# Altium schematic sheet ESP-WROOM32.SchDoc (part 2 of 3)
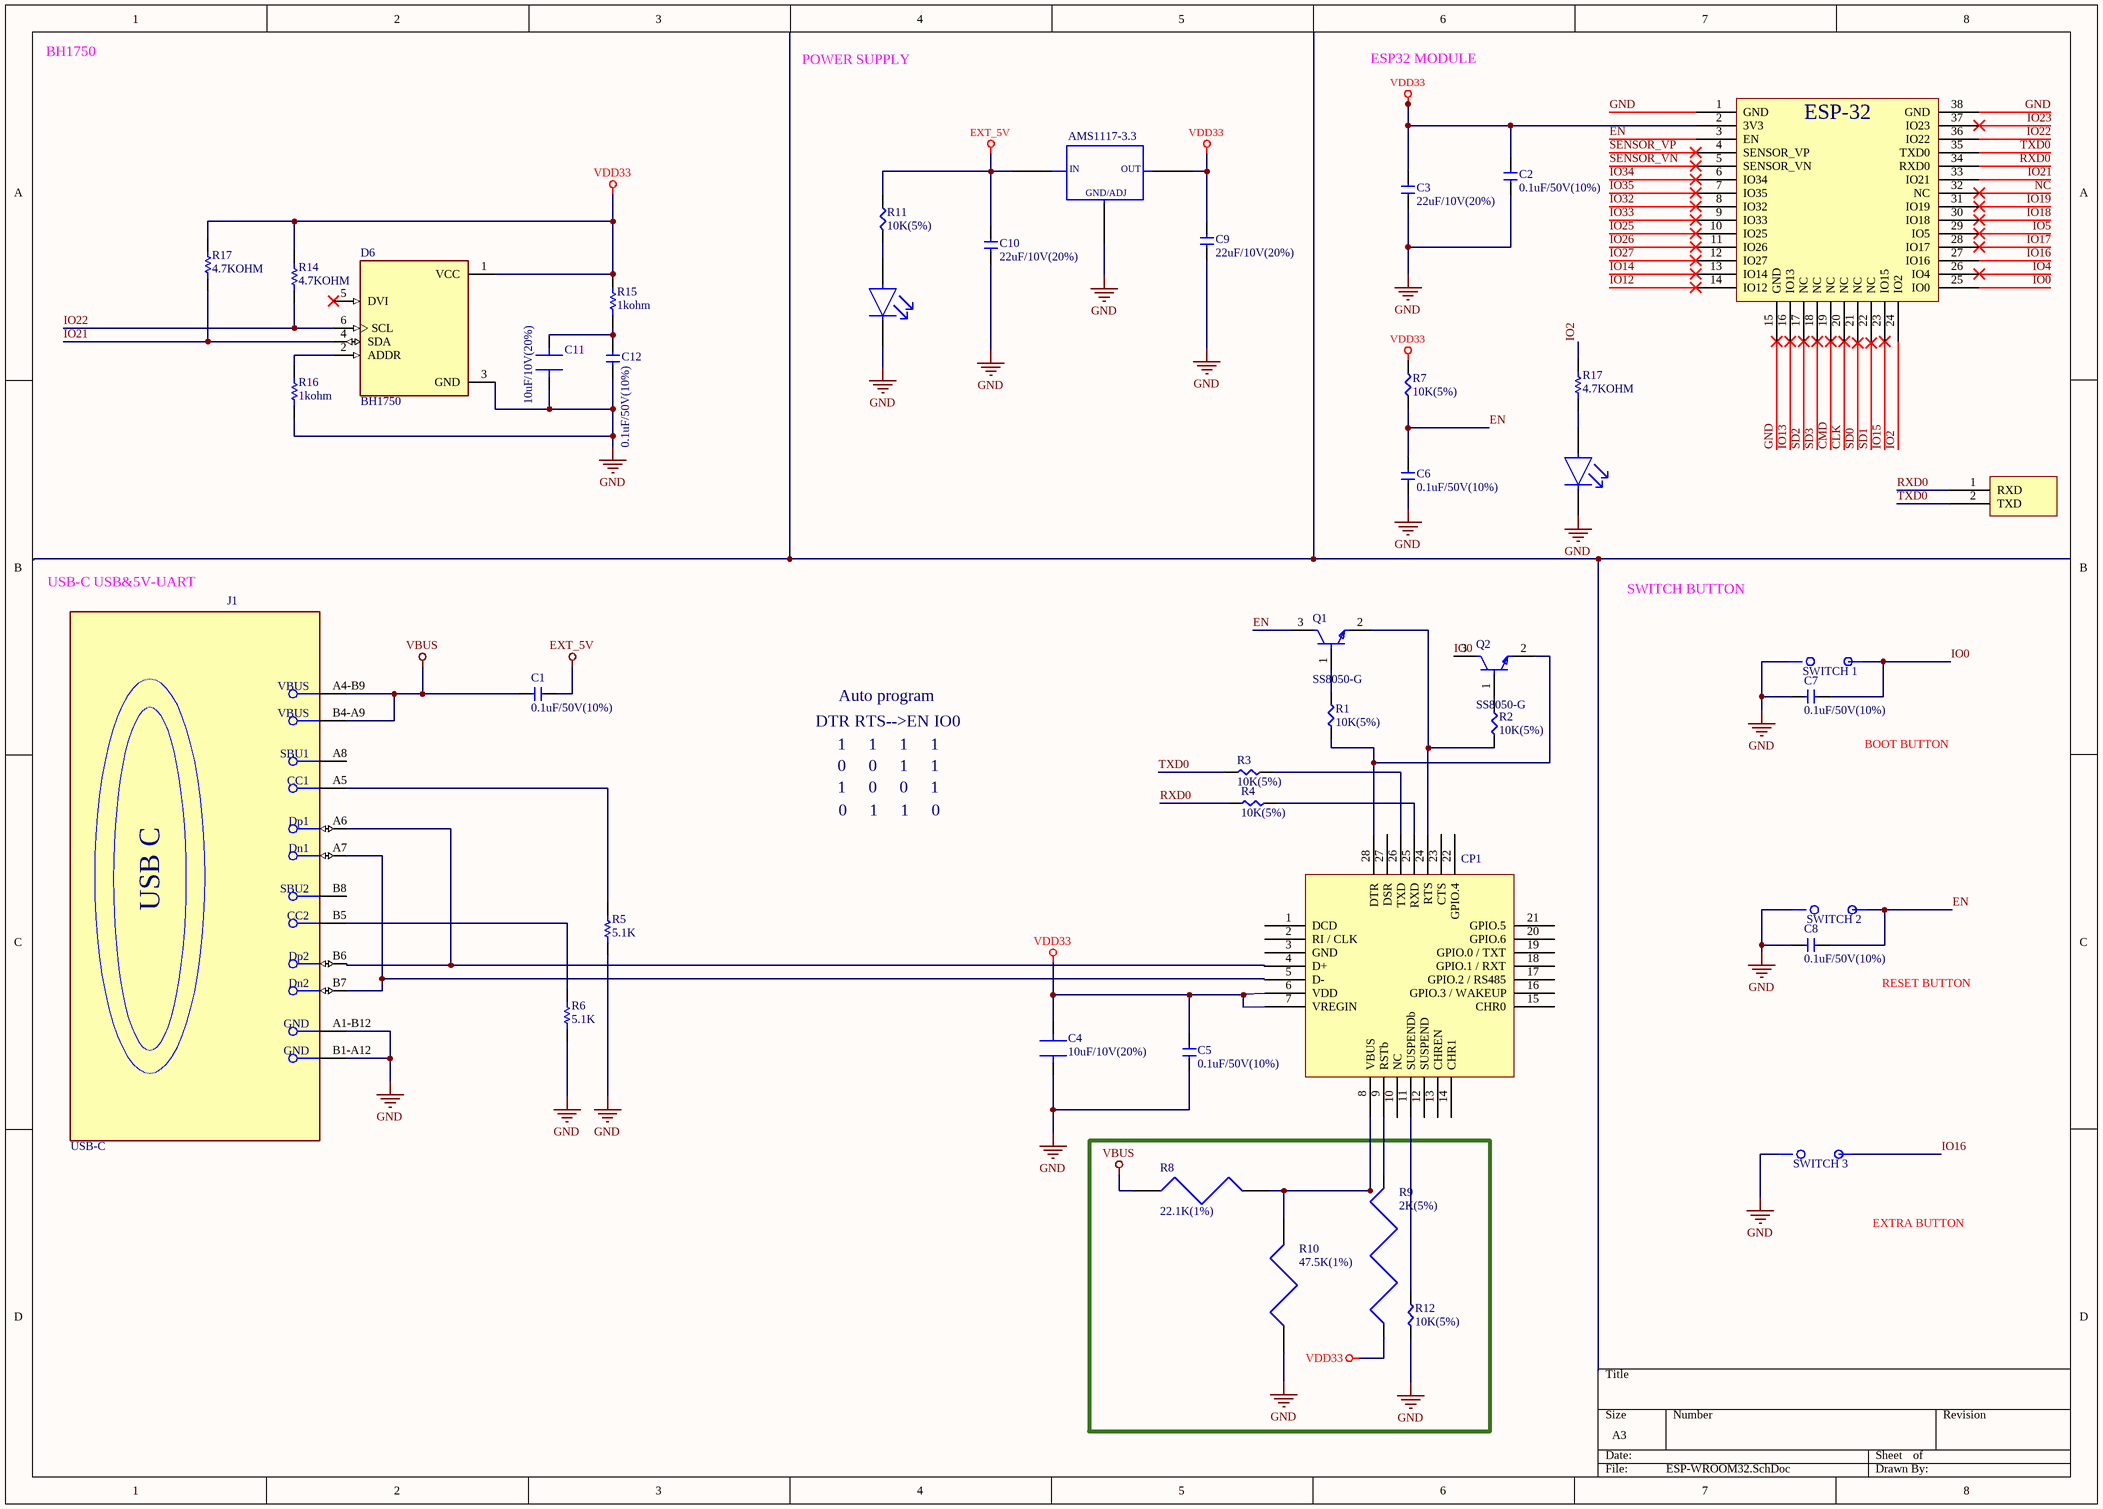
[diagram p1: ESP-WROOM32.SchDoc]
## Library data of the parts
* D4 = LTST-C170GKT: LED GREEN CLEAR SMD; Manufacturer: Lite-On; Current: 4A; Dominant Wavelength: 569nm; Forward Current: 30mA; Forward Voltage: 2.6V; Lens Color: Clear, Colorless; Luminous Intensity: 6mcd; Number of Circuits: 1; Peak Wavelength: 565nm; Power Dissipation: 100mW; Reverse Voltage: 5V; Shape: Rectangular; Test Current: 10mA; Viewing Angle: 130°; Supplier: DigiKey; Supplier Part Number: 160-1179-1-ND; Manufacturer Part Number: LTST-C170GKT; RoHS: Compliant; Category: LEDs; Stock: 1226220; Pricing: 1=0.1, 10=0.066, 100=0.0453, 500=0.03552, 1000=0.03224 (USD); Case/Package: 0805; Case Code (Imperial): 0805; Case Code (Metric): 2012; China RoHS: Compliant; Color: Green; Depth: 1.25mm; Height: 1.1mm; Illumination Color: Green; Lead Free: Lead Free; Length: 2mm; Lens Transparency: Clear; Lifecycle Status: Production; Max Operating Temperature: 85°C; Min Operating Temperature: -55°C; Mounting Technology: Surface Mount; Number of Elements: 1; Number of LEDs: 1; Pins: 2; Number of Terminals: 2; Packaging: Tape and Reel; Power Rating: 100mW; Radiation Hardening: No; REACH SVHC: Yes; Schedule B: 8541402000, 8541402000|8541402000|8541402000|8541402000|8541402000|8541402000|8541402000|8541402000|8541402000|8541402000|8541402000|8541402000|8541402000|8541402000|8541402000|8541402000|8541402000|8541402000|8541402000|8541402000|8541402000|8541402000|8541402000|85; Terminal Pitch: 2.1mm; Voltage: 5V; Wavelength: 569nm; Width: 1.25mm; ComponentLink1URL: https://datasheet.octopart.com:443/LTST-C170GKT-Lite-On-datasheet-180605137.pdf?src-supplier=IHS; ComponentLink1Description: https://datasheet.octopart.com:443/LTST-C170GKT-Lite-On-datasheet-180605137.pdf?src-supplier=IHS; ComponentLink2URL: https://datasheet.octopart.com:443/LTST-C170GKT-Lite-On-datasheet-141439001.pdf?src-supplier=Upverter; ComponentLink2Description: https://datasheet.octopart.com:443/LTST-C170GKT-Lite-On-datasheet-141439001.pdf?src-supplier=Upverter; ComponentLink3URL: https://datasheet.octopart.com:443/LTST-C170GKT-Lite-On-datasheet-159307.pdf?src-supplier=Arrow+Electronics; ComponentLink3Description: https://datasheet.octopart.com:443/LTST-C170GKT-Lite-On-datasheet-159307.pdf?src-supplier=Arrow+Electronics; ComponentLink4URL: https://datasheet.octopart.com:443/LTST-C170GKT-Lite-On-datasheet-8330158.pdf?src-supplier=TME; ComponentLink4Description: https://datasheet.octopart.com:443/LTST-C170GKT-Lite-On-datasheet-8330158.pdf?src-supplier=TME; ComponentLink5URL: https://datasheet.octopart.com:443/LTST-C170GKT-Lite-On-datasheet-26684672.pdf?src-supplier=Future+Electronics; ComponentLink5Description: https://datasheet.octopart.com:443/LTST-C170GKT-Lite-On-datasheet-26684672.pdf?src-supplier=Future+Electronics; ComponentLink6URL: https://datasheet.octopart.com:443/LTST-C170GKT-Lite-On-datasheet-59241.pdf?src-supplier=DigiKey; ComponentLink6Description: https://datasheet.octopart.com:443/LTST-C170GKT-Lite-On-datasheet-59241.pdf?src-supplier=DigiKey; ComponentLink7URL: https://datasheet.octopart.com:443/LTST-C170GKT-Lite-On-datasheet-14174986.pdf?src-supplier=iiiC; ComponentLink7Description: https://datasheet.octopart.com:443/LTST-C170GKT-Lite-On-datasheet-14174986.pdf?src-supplier=iiiC; LCSC PART NUMBER: C125090
*1 = ESP32-WROOM-32E-N4: RF TXRX MOD BT WIFI TH SMD; Manufacturer: Espressif Systems; Max Supply Voltage: 3.6V; Min Supply Voltage: 3V; Operating Supply Voltage: 3.3V; Supplier: DigiKey; Supplier Part Number: 1965-ESP32-WROOM-32E-N4CT-ND; Manufacturer Part Number: ESP32-WROOM-32E-N4; RoHS: Compliant; Category: System on Chip (SoC); Stock: 16186; Pricing: 1=4.84, 10=4.189, 25=3.9612, 100=3.649, 250=3.46184 (USD); Height - Seated (Max): 3.25mm; Length: 25.5mm; Max Operating Temperature: 85°C; Min Operating Temperature: -40°C; Number of Terminals: 38; Terminal Pitch: 1.27mm; Width: 18mm; ComponentLink1URL: https://datasheet.octopart.com:443/ESP32-WROOM-32E-N4-Espressif-Systems-datasheet-182247776.pdf?src-supplier=IHS; ComponentLink1Description: https://datasheet.octopart.com:443/ESP32-WROOM-32E-N4-Espressif-Systems-datasheet-182247776.pdf?src-supplier=IHS; ComponentLink2URL: https://datasheet.octopart.com:443/ESP32-WROOM-32E-N4-Espressif-Systems-datasheet-188867343.pdf?src-supplier=TME; ComponentLink2Description: https://datasheet.octopart.com:443/ESP32-WROOM-32E-N4-Espressif-Systems-datasheet-188867343.pdf?src-supplier=TME; ComponentLink3URL: https://datasheet.octopart.com:443/ESP32-WROOM-32E-N4-Espressif-Systems-datasheet-165560559.pdf?src-supplier=TME; ComponentLink3Description: https://datasheet.octopart.com:443/ESP32-WROOM-32E-N4-Espressif-Systems-datasheet-165560559.pdf?src-supplier=TME; ComponentLink4URL: https://datasheet.octopart.com:443/ESP32-WROOM-32E-N4-Espressif-Systems-datasheet-151884363.pdf?src-supplier=Future+Electronics; ComponentLink4Description: https://datasheet.octopart.com:443/ESP32-WROOM-32E-N4-Espressif-Systems-datasheet-151884363.pdf?src-supplier=Future+Electronics; LCSC part number: C701341
C1 C2 C5-C8 C12 = C1206C104K5JACAUTO: CAP CER 0.1UF 50V U2J 1206; Manufacturer: Samsung Electro-Mechanics; Manufacturer Part Number: CL05B104KB5NNWC; LSCS PART NUMBER: C2264143; Value: 100nF; Dielectric Material: Ceramic; Supplier: DigiKey; Supplier Part Number: 1276-CL05B104KB5NNWCCT-ND; RoHS: Compliant; Category: Ceramic Capacitors; Stock: 89724; Pricing: 1=0.1, 10=0.054, 50=0.037, 100=0.0319, 500=0.02338, 1000=0.02075, 2500=0.018, 5000=0.01634 (USD); China RoHS: Compliant; Lifecycle Status: Production; Max Operating Temperature: 125°C; Min Operating Temperature: -55°C; Mounting Technology: Surface Mount; Number of Terminals: 2; REACH SVHC: Yes; Schedule B: 8532240020, 8532240020|8532240020|8532240020|8532240020|8532240020; Voltage Rating (DC): 50V; ComponentLink1URL: https://datasheet.octopart.com:443/CL05B104KB5NNWC-Samsung-Electro-Mechanics-datasheet-182018729.pdf?src-supplier=IHS; ComponentLink1Description: https://datasheet.octopart.com:443/CL05B104KB5NNWC-Samsung-Electro-Mechanics-datasheet-182018729.pdf?src-supplier=IHS; LCSC part number: C7229230; Case/Package: 1206; Dielectric: U2J; Height: 1.2mm; Length: 3.2mm; Material: Ceramic; Voltage Rating: 50V; Width: 1.6mm; ComponentLink2URL: https://datasheet.octopart.com:443/C1206C104K5JACAUTO-KEMET-datasheet-175574894.pdf?src-supplier=IHS; ComponentLink2Description: https://datasheet.octopart.com:443/C1206C104K5JACAUTO-KEMET-datasheet-175574894.pdf?src-supplier=IHS; ComponentLink3URL: https://datasheet.octopart.com:443/C1206C104K5JACAUTO-KEMET-datasheet-138896532.pdf?src-supplier=Upverter; ComponentLink3Description: https://datasheet.octopart.com:443/C1206C104K5JACAUTO-KEMET-datasheet-138896532.pdf?src-supplier=Upverter; ComponentLink4URL: https://datasheet.octopart.com:443/C1206C104K5JACAUTO-KEMET-datasheet-141421995.pdf?src-supplier=Farnell; ComponentLink4Description: https://datasheet.octopart.com:443/C1206C104K5JACAUTO-KEMET-datasheet-141421995.pdf?src-supplier=Farnell; ComponentLink5URL: https://datasheet.octopart.com:443/C1206C104K5JACAUTO-KEMET-datasheet-110724407.pdf?src-supplier=RS+(Formerly+Allied+Electronics); ComponentLink5Description: https://datasheet.octopart.com:443/C1206C104K5JACAUTO-KEMET-datasheet-110724407.pdf?src-supplier=RS+(Formerly+Allied+Electronics)
C3 C9 C10 = CC1206MKX5R6BB226: CAP CER 22UF 10V X5R 1206; Manufacturer: Murata; Manufacturer Part Number: GRM158R61A226ME15D; Manufacturer Lifecycle Status: IN PRODUCTION; LSCS PART NUMBER: C723738; Value: 22µF; Dielectric Material: Ceramic; Supplier: DigiKey; Supplier Part Number: 490-GRM158R61A226ME15DCT-ND; RoHS: Compliant; Category: Ceramic Capacitors; Stock: 340623; Pricing: 1=0.41, 10=0.247, 50=0.1828, 100=0.1632, 500=0.1301, 1000=0.1199, 2500=0.10912 (USD); Case/Package: 0402; Dielectric: X5R; Height: 800µm; Length: 1mm; Lifecycle Status: Production; Material: Ceramic; Max Operating Temperature: 85°C; Min Operating Temperature: -55°C; Mounting Technology: Surface Mount; Number of Terminals: 2; REACH SVHC: Yes; Thickness: 800µm; Tolerance: 20%; Voltage Rating: 10V; Voltage Rating (DC): 10V; Width: 500µm; ComponentLink1URL: https://datasheet.octopart.com:443/GRM158R61A226ME15D-Murata-datasheet-165579666.pdf?src-supplier=TME; ComponentLink1Description: https://datasheet.octopart.com:443/GRM158R61A226ME15D-Murata-datasheet-165579666.pdf?src-supplier=TME; ComponentLink2URL: https://datasheet.octopart.com/GRM158R61A226ME15D-Murata-datasheet-12515295.pdf; ComponentLink2Description: https://datasheet.octopart.com/GRM158R61A226ME15D-Murata-datasheet-12515295.pdf; ComponentLink3URL: https://datasheet.octopart.com/GRM158R61A226ME15D-Murata-datasheet-12510076.pdf; ComponentLink3Description: https://datasheet.octopart.com/GRM158R61A226ME15D-Murata-datasheet-12510076.pdf; ComponentLink4URL: https://datasheet.octopart.com/GRM158R61A226ME15D-Murata-datasheet-11978611.pdf; ComponentLink4Description: https://datasheet.octopart.com/GRM158R61A226ME15D-Murata-datasheet-11978611.pdf; ComponentLink5URL: https://datasheet.octopart.com/GRM158R61A226ME15D-Murata-datasheet-10025737.pdf; ComponentLink5Description: https://datasheet.octopart.com/GRM158R61A226ME15D-Murata-datasheet-10025737.pdf; ComponentLink6URL: https://datasheet.octopart.com/GRM158R61A226ME15D-Murata-datasheet-8819587.pdf; ComponentLink6Description: https://datasheet.octopart.com/GRM158R61A226ME15D-Murata-datasheet-8819587.pdf; ComponentLink7URL: http://sigma.octopart.com:80/reach_statement/Murata-company-16.pdf?src-supplier=Compliance+Statements; ComponentLink7Description: http://sigma.octopart.com:80/reach_statement/Murata-company-16.pdf?src-supplier=Compliance+Statements; LCSC part number: C3845593; Case Code (Imperial): 1206; Case Code (Metric): 3216; China RoHS: Compliant; Halogen Free: Halogen Free; Lead Free: Lead Free; Schedule B: 8532240020, 8532240020|8532240020|8532240020|8532240020|8532240020; ComponentLink8URL: https://datasheet.octopart.com:443/CC1206MKX5R6BB226-Yageo-datasheet-170350636.pdf?src-supplier=IHS; ComponentLink8Description: https://datasheet.octopart.com:443/CC1206MKX5R6BB226-Yageo-datasheet-170350636.pdf?src-supplier=IHS; ComponentLink9URL: https://datasheet.octopart.com:443/CC1206MKX5R6BB226-Yageo-datasheet-182965674.pdf?src-supplier=Farnell; ComponentLink9Description: https://datasheet.octopart.com:443/CC1206MKX5R6BB226-Yageo-datasheet-182965674.pdf?src-supplier=Farnell; ComponentLink10URL: https://datasheet.octopart.com:443/CC1206MKX5R6BB226-Yageo-Group-datasheet-145016144.pdf?src-supplier=ODG+(Origin+Data+Global); ComponentLink10Description: https://datasheet.octopart.com:443/CC1206MKX5R6BB226-Yageo-Group-datasheet-145016144.pdf?src-supplier=ODG+(Origin+Data+Global); ComponentLink11URL: https://datasheet.octopart.com:443/CC1206MKX5R6BB226-Yageo-datasheet-137700085.pdf?src-supplier=Future+Electronics; ComponentLink11Description: https://datasheet.octopart.com:443/CC1206MKX5R6BB226-Yageo-datasheet-137700085.pdf?src-supplier=Future+Electronics; ComponentLink12URL: https://datasheet.octopart.com:443/CC1206MKX5R6BB226-Yageo-datasheet-82288757.pdf?src-supplier=Future+Electronics; ComponentLink12Description: https://datasheet.octopart.com:443/CC1206MKX5R6BB226-Yageo-datasheet-82288757.pdf?src-supplier=Future+Electronics; ComponentLink13URL: https://datasheet.octopart.com:443/CC1206MKX5R6BB226-Yageo-datasheet-78855685.pdf?src-supplier=Future+Electronics; ComponentLink13Description: https://datasheet.octopart.com:443/CC1206MKX5R6BB226-Yageo-datasheet-78855685.pdf?src-supplier=Future+Electronics; ComponentLink14URL: https://datasheet.octopart.com:443/CC1206MKX5R6BB226-Yageo-datasheet-62336348.pdf?src-supplier=Future+Electronics; ComponentLink14Description: https://datasheet.octopart.com:443/CC1206MKX5R6BB226-Yageo-datasheet-62336348.pdf?src-supplier=Future+Electronics; ComponentLink15URL: https://datasheet.octopart.com:443/CC1206MKX5R6BB226-Yageo-datasheet-68298032.pdf?src-supplier=Future+Electronics; ComponentLink15Description: https://datasheet.octopart.com:443/CC1206MKX5R6BB226-Yageo-datasheet-68298032.pdf?src-supplier=Future+Electronics; ComponentLink16URL: https://datasheet.octopart.com/CC1206MKX5R6BB226-Yageo-datasheet-86397281.pdf; ComponentLink16Description: https://datasheet.octopart.com/CC1206MKX5R6BB226-Yageo-datasheet-86397281.pdf; ComponentLink17URL: http://sigma.octopart.com:80/rohs_statement/Yageo-company-2.pdf?src-supplier=Compliance+Statements; ComponentLink17Description: http://sigma.octopart.com:80/rohs_statement/Yageo-company-2.pdf?src-supplier=Compliance+Statements; ComponentLink18URL: http://sigma.octopart.com:80/conflict_mineral_statement/Yageo-company-3.pdf?src-supplier=Compliance+Statements; ComponentLink18Description: http://sigma.octopart.com:80/conflict_mineral_statement/Yageo-company-3.pdf?src-supplier=Compliance+Statements
C4 C11 = CC1206KKX5R6BB106: CAP CER 10UF 10V X5R 1206; Manufacturer: Yageo Group; Manufacturer Part Number: CC0402MRX5R6BB106; LSCS PART NUMBER: C527332; Value: 10µF; Dielectric Material: Ceramic; Tolerance: 10%; Supplier: DigiKey; Supplier Part Number: 13-CC0402MRX5R6BB106CT-ND; RoHS: Compliant; Category: Ceramic Capacitors; Stock: 59624; Pricing: 1=0.21, 10=0.121, 50=0.0866, 100=0.076, 500=0.05824, 1000=0.05277, 2500=0.04701, 5000=0.04354 (USD); Case/Package: 0402; China RoHS: Compliant; Dielectric: X5R; Halogen Free: Halogen Free; Height: 500µm; Lead Free: Lead Free; Length: 1mm; Lifecycle Status: Production; Max Operating Temperature: 85°C; Min Operating Temperature: -55°C; Mounting Technology: Surface Mount; Number of Terminals: 2; REACH SVHC: Yes; Voltage Rating (DC): 10V; Width: 500µm; ComponentLink1URL: https://datasheet.octopart.com:443/CC0402MRX5R6BB106-Yageo-datasheet-170350636.pdf?src-supplier=IHS; ComponentLink1Description: https://datasheet.octopart.com:443/CC0402MRX5R6BB106-Yageo-datasheet-170350636.pdf?src-supplier=IHS; ComponentLink2URL: https://datasheet.octopart.com:443/CC0402MRX5R6BB106-Yageo-Group-datasheet-189192896.pdf?src-supplier=TME; ComponentLink2Description: https://datasheet.octopart.com:443/CC0402MRX5R6BB106-Yageo-Group-datasheet-189192896.pdf?src-supplier=TME; ComponentLink3URL: https://datasheet.octopart.com:443/CC0402MRX5R6BB106-Yageo-datasheet-182029486.pdf?src-supplier=Newark; ComponentLink3Description: https://datasheet.octopart.com:443/CC0402MRX5R6BB106-Yageo-datasheet-182029486.pdf?src-supplier=Newark; ComponentLink4URL: https://datasheet.octopart.com:443/CC0402MRX5R6BB106-Yageo-datasheet-158238148.pdf?src-supplier=Newark; ComponentLink4Description: https://datasheet.octopart.com:443/CC0402MRX5R6BB106-Yageo-datasheet-158238148.pdf?src-supplier=Newark; ComponentLink5URL: https://datasheet.octopart.com/CC0402MRX5R6BB106-Yageo-datasheet-86397281.pdf; ComponentLink5Description: https://datasheet.octopart.com/CC0402MRX5R6BB106-Yageo-datasheet-86397281.pdf; ComponentLink6URL: https://datasheet.octopart.com:443/CC0402MRX5R6BB106-Yageo-datasheet-175963154.pdf?src-supplier=element14+APAC; ComponentLink6Description: https://datasheet.octopart.com:443/CC0402MRX5R6BB106-Yageo-datasheet-175963154.pdf?src-supplier=element14+APAC; ComponentLink7URL: https://datasheet.octopart.com:443/CC0402MRX5R6BB106-Yageo-Group-datasheet-145016144.pdf?src-supplier=ODG+(Origin+Data+Global); ComponentLink7Description: https://datasheet.octopart.com:443/CC0402MRX5R6BB106-Yageo-Group-datasheet-145016144.pdf?src-supplier=ODG+(Origin+Data+Global); ComponentLink8URL: https://datasheet.octopart.com:443/CC0402MRX5R6BB106-Yageo-datasheet-62067349.pdf?src-supplier=Future+Electronics; ComponentLink8Description: https://datasheet.octopart.com:443/CC0402MRX5R6BB106-Yageo-datasheet-62067349.pdf?src-supplier=Future+Electronics; ComponentLink9URL: http://sigma.octopart.com:80/conflict_mineral_statement/Yageo-company-3.pdf?src-supplier=Compliance+Statements; ComponentLink9Description: http://sigma.octopart.com:80/conflict_mineral_statement/Yageo-company-3.pdf?src-supplier=Compliance+Statements; ComponentLink10URL: http://sigma.octopart.com:80/rohs_statement/Yageo-company-2.pdf?src-supplier=Compliance+Statements; ComponentLink10Description: http://sigma.octopart.com:80/rohs_statement/Yageo-company-2.pdf?src-supplier=Compliance+Statements; LCSC PART NUMBER: C962143; Case Code (Imperial): 1206; Case Code (Metric): 3216; Composition: Ceramic; Depth: 1.6mm; Pins: 2; Radiation Hardening: No; Termination: SMD/SMT; Thickness: 1.8034mm; Voltage Rating: 10V; Voltage Rating (AC): 10V; Weight: 16.187578mg; ComponentLink11URL: https://datasheet.octopart.com:443/CC1206KKX5R6BB106-Yageo-datasheet-170350636.pdf?src-supplier=IHS; ComponentLink11Description: https://datasheet.octopart.com:443/CC1206KKX5R6BB106-Yageo-datasheet-170350636.pdf?src-supplier=IHS; ComponentLink12URL: https://datasheet.octopart.com:443/CC1206KKX5R6BB106-Yageo-datasheet-10911834.pdf?src-supplier=element14+APAC; ComponentLink12Description: https://datasheet.octopart.com:443/CC1206KKX5R6BB106-Yageo-datasheet-10911834.pdf?src-supplier=element14+APAC; ComponentLink13URL: https://datasheet.octopart.com:443/CC1206KKX5R6BB106-Yageo-datasheet-62067349.pdf?src-supplier=element14+APAC; ComponentLink13Description: https://datasheet.octopart.com:443/CC1206KKX5R6BB106-Yageo-datasheet-62067349.pdf?src-supplier=element14+APAC; ComponentLink14URL: https://datasheet.octopart.com:443/CC1206KKX5R6BB106-Yageo-datasheet-181970622.pdf?src-supplier=Farnell; ComponentLink14Description: https://datasheet.octopart.com:443/CC1206KKX5R6BB106-Yageo-datasheet-181970622.pdf?src-supplier=Farnell; ComponentLink15URL: https://datasheet.octopart.com:443/CC1206KKX5R6BB106-Yageo-datasheet-181970623.pdf?src-supplier=Farnell; ComponentLink15Description: https://datasheet.octopart.com:443/CC1206KKX5R6BB106-Yageo-datasheet-181970623.pdf?src-supplier=Farnell; ComponentLink16URL: https://datasheet.octopart.com:443/CC1206KKX5R6BB106-Yageo-datasheet-175963154.pdf?src-supplier=JRH+Electronics; ComponentLink16Description: https://datasheet.octopart.com:443/CC1206KKX5R6BB106-Yageo-datasheet-175963154.pdf?src-supplier=JRH+Electronics; ComponentLink17URL: https://datasheet.octopart.com:443/CC1206KKX5R6BB106-Yageo-datasheet-158238148.pdf?src-supplier=Newark; ComponentLink17Description: https://datasheet.octopart.com:443/CC1206KKX5R6BB106-Yageo-datasheet-158238148.pdf?src-supplier=Newark; ComponentLink18URL: https://datasheet.octopart.com:443/CC1206KKX5R6BB106-Yageo-datasheet-8359971.pdf?src-supplier=Newark; ComponentLink18Description: https://datasheet.octopart.com:443/CC1206KKX5R6BB106-Yageo-datasheet-8359971.pdf?src-supplier=Newark; ComponentLink19URL: https://datasheet.octopart.com/CC1206KKX5R6BB106-Yageo-datasheet-86397281.pdf; ComponentLink19Description: https://datasheet.octopart.com/CC1206KKX5R6BB106-Yageo-datasheet-86397281.pdf; ComponentLink20URL: https://datasheet.octopart.com:443/CC1206KKX5R6BB106-Yageo-datasheet-8324442.pdf?src-supplier=Future+Electronics; ComponentLink20Description: https://datasheet.octopart.com:443/CC1206KKX5R6BB106-Yageo-datasheet-8324442.pdf?src-supplier=Future+Electronics; ComponentLink21URL: https://datasheet.octopart.com:443/CC1206KKX5R6BB106-Yageo-datasheet-137875056.pdf?src-supplier=Future+Electronics; ComponentLink21Description: https://datasheet.octopart.com:443/CC1206KKX5R6BB106-Yageo-datasheet-137875056.pdf?src-supplier=Future+Electronics; ComponentLink22URL: https://datasheet.octopart.com:443/CC1206KKX5R6BB106-Yageo-datasheet-59875459.pdf?src-supplier=Future+Electronics; ComponentLink22Description: https://datasheet.octopart.com:443/CC1206KKX5R6BB106-Yageo-datasheet-59875459.pdf?src-supplier=Future+Electronics; ComponentLink23URL: https://datasheet.octopart.com:443/CC1206KKX5R6BB106-Yageo-datasheet-27626583.pdf?src-supplier=Future+Electronics; ComponentLink23Description: https://datasheet.octopart.com:443/CC1206KKX5R6BB106-Yageo-datasheet-27626583.pdf?src-supplier=Future+Electronics; ComponentLink24URL: https://datasheet.octopart.com:443/CC1206KKX5R6BB106-Yageo-datasheet-24580494.pdf?src-supplier=Future+Electronics; ComponentLink24Description: https://datasheet.octopart.com:443/CC1206KKX5R6BB106-Yageo-datasheet-24580494.pdf?src-supplier=Future+Electronics; ComponentLink25URL: https://datasheet.octopart.com:443/CC1206KKX5R6BB106-Yageo-datasheet-14389981.pdf?src-supplier=Future+Electronics; ComponentLink25Description: https://datasheet.octopart.com:443/CC1206KKX5R6BB106-Yageo-datasheet-14389981.pdf?src-supplier=Future+Electronics; ComponentLink26URL: https://datasheet.octopart.com:443/CC1206KKX5R6BB106-Yageo-datasheet-149070021.pdf?src-supplier=TME; ComponentLink26Description: https://datasheet.octopart.com:443/CC1206KKX5R6BB106-Yageo-datasheet-149070021.pdf?src-supplier=TME; ComponentLink27URL: https://datasheet.octopart.com:443/CC1206KKX5R6BB106-Yageo-Group-datasheet-145016144.pdf?src-supplier=ODG+(Origin+Data+Global); ComponentLink27Description: https://datasheet.octopart.com:443/CC1206KKX5R6BB106-Yageo-Group-datasheet-145016144.pdf?src-supplier=ODG+(Origin+Data+Global)
CP1 = CP2102N-A02-GQFN28: USB Bridge, USB to UART USB 2.0 UART Interface 28-QFN (5x5); Manufacturer: Silicon Labs; Manufacturer Lifecycle Status: FULL PRODUCTION; Data Rate: 1.5Mbps; Max Junction Temperature (Tj): 105°C; Max Supply Voltage: 3.6V; Min Supply Voltage: 3V; Number of Digital IO: 7; Number of Ports: 1; Operating Supply Voltage: 3.3V; USB Standard: USB 2.0; Supplier: DigiKey; Supplier Part Number: 336-5889-ND; Manufacturer Part Number: CP2102N-A02-GQFN28; RoHS: Compliant; Category: USB Interface ICs; Stock: 1307; Pricing: 1=4.32, 10=3.275, 73=2.78205, 146=2.66534, 292=2.56928, 511=2.50429, 1022=2.43673, 2555=2.36542 (USD); Ambient Temperature Range High: 85°C; China RoHS: Compliant; Height: 800µm; Height - Seated (Max): 800µm; Interface: UART; Length: 5mm; Lifecycle Status: Production; Max Operating Temperature: 85°C; Min Operating Temperature: -40°C; Number of Terminals: 28; REACH SVHC: Yes; Terminal Pitch: 500µm; Width: 5mm; ComponentLink1URL: https://datasheet.octopart.com:443/CP2102N-A02-GQFN28-Silicon-Labs-datasheet-138898368.pdf?src-supplier=Augswan; ComponentLink1Description: https://datasheet.octopart.com:443/CP2102N-A02-GQFN28-Silicon-Labs-datasheet-138898368.pdf?src-supplier=Augswan; ComponentLink2URL: https://datasheet.octopart.com:443/CP2102N-A02-GQFN28-Silicon-Labs-datasheet-166051788.pdf?src-supplier=IHS; ComponentLink2Description: https://datasheet.octopart.com:443/CP2102N-A02-GQFN28-Silicon-Labs-datasheet-166051788.pdf?src-supplier=IHS; LCSC PART NUMBER: C964632
D6 = BH1750FVI-TR: SENSOR OPT 560NM AMBIENT 6WSOF; Manufacturer: ROHM; Interface: I2C, Serial; Clock Frequency: 400kHz; Max Power Dissipation: 260mW; Max Supply Voltage: 3.6V; Min Supply Voltage: 2.4V; Number of Circuits: 1; Operating Supply Current: 120µA; Operating Supply Voltage: 3V; Output Type: Digital, I2C; Sensing Method: Optical; Type: Integrated Circuit (IC); Supplier: DigiKey; Supplier Part Number: BH1750FVICT-ND; Manufacturer Part Number: BH1750FVI-TR; RoHS: Compliant; Category: Optical Sensors; Stock: 3509; Pricing: 1=3.29, 5=2.934, 10=2.804, 25=2.648, 50=2.542, 100=2.4447, 500=2.24896, 1000=2.18484 (USD); Case/Package: SMD/SMT; Contact Plating: Copper, Tin; Height: 750µm; Height - Seated (Max): 750µm; Lead Free: Lead Free; Length: 2.6mm; Lifecycle Status: Obsolete; Max Operating Temperature: 85°C; Min Operating Temperature: -40°C; Mounting Technology: Surface Mount; Pins: 6; Number of Terminals: 6; Radiation Hardening: No; REACH SVHC: Yes; Schedule B: 8541409500; Terminal Pitch: 500µm; Wavelength: 560nm; Width: 1.6mm; ComponentLink1URL: https://sigma.octopart.com:443/169791153/technical_drawing/ROHM-BH1750FVI-TR.pdf?src-supplier=Upverter; ComponentLink1Description: https://sigma.octopart.com:443/169791153/technical_drawing/ROHM-BH1750FVI-TR.pdf?src-supplier=Upverter; ComponentLink2URL: https://datasheet.octopart.com:443/BH1750FVI-TR-Rohm-datasheet-141422541.pdf?src-supplier=Upverter; ComponentLink2Description: https://datasheet.octopart.com:443/BH1750FVI-TR-Rohm-datasheet-141422541.pdf?src-supplier=Upverter; ComponentLink3URL: https://datasheet.octopart.com:443/BH1750FVI-TR-ROHM-datasheet-169791149.pdf?src-supplier=Upverter; ComponentLink3Description: https://datasheet.octopart.com:443/BH1750FVI-TR-ROHM-datasheet-169791149.pdf?src-supplier=Upverter; ComponentLink4URL: https://datasheet.octopart.com:443/BH1750FVI-TR-Rohm-datasheet-25365051.pdf?src-supplier=Newark; ComponentLink4Description: https://datasheet.octopart.com:443/BH1750FVI-TR-Rohm-datasheet-25365051.pdf?src-supplier=Newark; ComponentLink5URL: https://datasheet.octopart.com:443/BH1750FVI-TR-Rohm-datasheet-8331172.pdf?src-supplier=_legacy+Avnet; ComponentLink5Description: https://datasheet.octopart.com:443/BH1750FVI-TR-Rohm-datasheet-8331172.pdf?src-supplier=_legacy+Avnet; ComponentLink6URL: https://datasheet.octopart.com:443/BH1750FVI-TR-Rohm-datasheet-145014626.pdf?src-supplier=Future+Electronics; ComponentLink6Description: https://datasheet.octopart.com:443/BH1750FVI-TR-Rohm-datasheet-145014626.pdf?src-supplier=Future+Electronics; ComponentLink7URL: https://datasheet.octopart.com:443/BH1750FVI-TR-Rohm-datasheet-14434783.pdf?src-supplier=Factory+Futures; ComponentLink7Description: https://datasheet.octopart.com:443/BH1750FVI-TR-Rohm-datasheet-14434783.pdf?src-supplier=Factory+Futures; LCSC PART NUMBER: C78960
J1 = 2171790001: CONN RCP USB2.0 TYP C 24P SMD RA; Manufacturer: Molex; Manufacturer Part Number: 217179-0001; Contact Resistance: 50mΩ; Current Rating: 1.25A; Dielectric Material: Polyamide; Gender: Receptacle; Insulation Resistance: 100MΩ; Number of Contacts: 16; Number of Ports: 1; Voltage Rating: 30V; Supplier: DigiKey; Supplier Part Number: 900-2171790001CT-ND; RoHS: Compliant; Category: USB Connectors; Stock: 5295; Pricing: 1=0.83, 10=0.704, 25=0.6596, 50=0.628, 100=0.598, 250=0.56052, 500=0.53374 (USD); Contact Gender: Female; Contact Material: Gold, Nickel; Height: 3.36mm; Lifecycle Status: Production; Max Operating Temperature: 85°C; Min Operating Temperature: -40°C; Pins: 16; Number of Rows: 1; REACH SVHC: Yes; Shell Finish: Nickel; Shell Material: Stainless Steel; Terminal Pitch: 500µm; USB Standard: USB 2.0; ComponentLink1URL: https://datasheet.octopart.com:443/217179-0001-Molex-datasheet-158871109.pdf?src-supplier=ODG+(Origin+Data+Global); ComponentLink1Description: https://datasheet.octopart.com:443/217179-0001-Molex-datasheet-158871109.pdf?src-supplier=ODG+(Origin+Data+Global); ComponentLink2URL: https://sigma.octopart.com:443/158871110/technical_drawing/Molex-217179-0001.pdf?src-supplier=Upverter; ComponentLink2Description: https://sigma.octopart.com:443/158871110/technical_drawing/Molex-217179-0001.pdf?src-supplier=Upverter; ComponentLink3URL: https://datasheet.octopart.com:443/217179-0001-Molex-datasheet-164573281.pdf?src-supplier=RS+(Formerly+Allied+Electronics); ComponentLink3Description: https://datasheet.octopart.com:443/217179-0001-Molex-datasheet-164573281.pdf?src-supplier=RS+(Formerly+Allied+Electronics); ComponentLink4URL: http://sigma.octopart.com:80/conflict_mineral_statement/Molex-company-72.pdf?src-supplier=Compliance+Statements; ComponentLink4Description: http://sigma.octopart.com:80/conflict_mineral_statement/Molex-company-72.pdf?src-supplier=Compliance+Statements; ComponentLink5URL: http://sigma.octopart.com:80/rohs_statement/Molex-company-73.pdf?src-supplier=Compliance+Statements; ComponentLink5Description: http://sigma.octopart.com:80/rohs_statement/Molex-company-73.pdf?src-supplier=Compliance+Statements; ComponentLink6URL: http://sigma.octopart.com:80/reach_statement/Molex-company-74.pdf?src-supplier=Compliance+Statements; ComponentLink6Description: http://sigma.octopart.com:80/reach_statement/Molex-company-74.pdf?src-supplier=Compliance+Statements; LCSC PART NUMBER: C3197684
p1 = 342-10-102-00-591000: Conn Hdr DIP Post 2POS Gold; Manufacturer: DigiKey; Supplier: DigiKey; Supplier Part Number: ED10064-02-ND; Manufacturer Part Number: 342-10-102-00-591000; Category: Uncategorized; Stock: 5642; Pricing: 1=0.88, 10=0.749, 100=0.636, 500=0.56766, 1000=0.54056, 5000=0.48254, 10000=0.45952 (USD); lcsc part number: C17625479
Q1 Q2 = SS8050-G: TRANS NPN 25V 1.5A SOT-23-3; Manufacturer: Comchip; Collector Base Voltage (VCBO): 40V; Collector Emitter Saturation Voltage: 500mV; Emitter Base Voltage (VEBO): 5V; hFE Min: 40; Max Junction Temperature (Tj): 150°C; Max Power Dissipation: 300mW; Number of Elements: 1; Transition Frequency: 100MHz; Supplier: DigiKey; Supplier Part Number: 641-1790-1-ND; Manufacturer Part Number: SS8050-G; RoHS: Compliant; Category: BJTs; Stock: 59487; Pricing: 1=0.24, 10=0.148, 100=0.0921, 500=0.06754, 1000=0.05958 (USD); Case/Package: TO-236-3; Collector Emitter Breakdown Voltage: 25V; Collector Emitter Voltage (VCEO): 25V; Height: 1.15mm; Lifecycle Status: Production; Max Breakdown Voltage: 25V; Max Collector Current: 1.5A; Max Operating Temperature: 150°C; Mounting Technology: Surface Mount; Number of Terminals: 3; Power Dissipation: 300mW; REACH SVHC: Yes; Schedule B: 8541100070|8541100070|8541100070|8541100070|8541100070; ComponentLink1URL: https://datasheet.octopart.com:443/SS8050-G-Comchip-datasheet-180131983.pdf?src-supplier=IHS; ComponentLink1Description: https://datasheet.octopart.com:443/SS8050-G-Comchip-datasheet-180131983.pdf?src-supplier=IHS; ComponentLink2URL: https://datasheet.octopart.com:443/SS8050-G-Comchip-datasheet-155422643.pdf?src-supplier=Upverter; ComponentLink2Description: https://datasheet.octopart.com:443/SS8050-G-Comchip-datasheet-155422643.pdf?src-supplier=Upverter; ComponentLink3URL: https://datasheet.octopart.com:443/SS8050-G-Comchip-datasheet-189767092.pdf?src-supplier=ODG+(Origin+Data+Global); ComponentLink3Description: https://datasheet.octopart.com:443/SS8050-G-Comchip-datasheet-189767092.pdf?src-supplier=ODG+(Origin+Data+Global); LCSC PART NUMBER: C164886
R1-R4 R7 R11 R12 = RC1206JR-1310KL: RES 10K OHM 5% 1/4W 1206; Manufacturer: Yageo Group; Manufacturer Part Number: RC0402JR-0710KL; Max Power Dissipation: 63mW; Power Dissipation: 62.5mW; Value: 10kΩ; Temperature Coefficient: 100ppm/°C; Voltage Rating: 50V; Supplier: DigiKey; Supplier Part Number: 311-10KJRCT-ND; RoHS: Compliant; Category: Chip SMD Resistors; Stock: 11539169; Pricing: 1=0.1, 10=0.006, 25=0.0056, 50=0.0052, 100=0.0046, 250=0.00416, 500=0.00284 (USD); Case/Package: 0402; Case Code (Imperial): 0402; China RoHS: Non-Compliant; Composition: Thick Film; Depth: 500µm; Features: Moisture Resistant; Height: 350µm; Lead Free: Lead Free; Length: 1mm; Lifecycle Status: Production; Max Operating Temperature: 155°C; Military Standard: Not; Min Operating Temperature: -55°C; Mounting Technology: Surface Mount; Pins: 2; Number of Terminals: 2; Number of Terminations: 2; Packaging: Tape & Reel; Power Rating: 62.5mW; REACH SVHC: Yes; Schedule B: 8533210045, 8533210045|8533210045, 8533210045|8533210045|8533210045, 8533210045|8533210045|8533210045|8533210045; Termination: SMD/SMT; Tolerance: 5%; Voltage Rating (AC): 50V; Voltage Rating (DC): 50V; Width: 500µm; Working Voltage: 50V; ComponentLink1URL: https://datasheet.octopart.com:443/RC0402JR-0710KL-Yageo-datasheet-175887523.pdf?src-supplier=IHS; ComponentLink1Description: https://datasheet.octopart.com:443/RC0402JR-0710KL-Yageo-datasheet-175887523.pdf?src-supplier=IHS; ComponentLink2URL: https://datasheet.octopart.com:443/RC0402JR-0710KL-Yageo-datasheet-10408619.pdf?src-supplier=Newark; ComponentLink2Description: https://datasheet.octopart.com:443/RC0402JR-0710KL-Yageo-datasheet-10408619.pdf?src-supplier=Newark; ComponentLink3URL: https://datasheet.octopart.com:443/RC0402JR-0710KL-Yageo-datasheet-505231.pdf?src-supplier=Newark; ComponentLink3Description: https://datasheet.octopart.com:443/RC0402JR-0710KL-Yageo-datasheet-505231.pdf?src-supplier=Newark; ComponentLink4URL: https://datasheet.octopart.com:443/RC0402JR-0710KL-Yageo-datasheet-141265859.pdf?src-supplier=Upverter; ComponentLink4Description: https://datasheet.octopart.com:443/RC0402JR-0710KL-Yageo-datasheet-141265859.pdf?src-supplier=Upverter; ComponentLink5URL: https://sigma.octopart.com:443/138820526/technical_drawing/Yageo-RC0402JR-0710KL.pdf?src-supplier=Upverter; ComponentLink5Description: https://sigma.octopart.com:443/138820526/technical_drawing/Yageo-RC0402JR-0710KL.pdf?src-supplier=Upverter; ComponentLink6URL: https://datasheet.octopart.com:443/RC0402JR-0710KL-Yageo-datasheet-62067350.pdf?src-supplier=Farnell; ComponentLink6Description: https://datasheet.octopart.com:443/RC0402JR-0710KL-Yageo-datasheet-62067350.pdf?src-supplier=Farnell; ComponentLink7URL: https://datasheet.octopart.com:443/RC0402JR-0710KL-Yageo-datasheet-12531192.pdf?src-supplier=Seeed+Studio; ComponentLink7Description: https://datasheet.octopart.com:443/RC0402JR-0710KL-Yageo-datasheet-12531192.pdf?src-supplier=Seeed+Studio; ComponentLink8URL: https://datasheet.octopart.com:443/RC0402JR-0710KL-Yageo-datasheet-8324527.pdf?src-supplier=TME; ComponentLink8Description: https://datasheet.octopart.com:443/RC0402JR-0710KL-Yageo-datasheet-8324527.pdf?src-supplier=TME; ComponentLink9URL: https://datasheet.octopart.com:443/RC0402JR-0710KL-Yageo-datasheet-164759695.pdf?src-supplier=Future+Electronics; ComponentLink9Description: https://datasheet.octopart.com:443/RC0402JR-0710KL-Yageo-datasheet-164759695.pdf?src-supplier=Future+Electronics; ComponentLink10URL: https://datasheet.octopart.com:443/RC0402JR-0710KL-Yageo-datasheet-137700087.pdf?src-supplier=Future+Electronics; ComponentLink10Description: https://datasheet.octopart.com:443/RC0402JR-0710KL-Yageo-datasheet-137700087.pdf?src-supplier=Future+Electronics; ComponentLink11URL: https://datasheet.octopart.com/RC0402JR-0710KL-Yageo-datasheet-73766026.pdf; ComponentLink11Description: https://datasheet.octopart.com/RC0402JR-0710KL-Yageo-datasheet-73766026.pdf; ComponentLink12URL: https://datasheet.octopart.com:443/RC0402JR-0710KL-Yageo-datasheet-8329306.pdf?src-supplier=element14; ComponentLink12Description: https://datasheet.octopart.com:443/RC0402JR-0710KL-Yageo-datasheet-8329306.pdf?src-supplier=element14; ComponentLink13URL: http://sigma.octopart.com:80/rohs_statement/Yageo-company-2.pdf?src-supplier=Compliance+Statements; ComponentLink13Description: http://sigma.octopart.com:80/rohs_statement/Yageo-company-2.pdf?src-supplier=Compliance+Statements; ComponentLink14URL: http://sigma.octopart.com:80/conflict_mineral_statement/Yageo-company-3.pdf?src-supplier=Compliance+Statements; ComponentLink14Description: http://sigma.octopart.com:80/conflict_mineral_statement/Yageo-company-3.pdf?src-supplier=Compliance+Statements; LCSC part number: C4117928; Case Code (Metric): 3016; ComponentLink15URL: https://datasheet.octopart.com:443/AC1206JR-0710KL-Yageo-datasheet-182189377.pdf?src-supplier=IHS; ComponentLink15Description: https://datasheet.octopart.com:443/AC1206JR-0710KL-Yageo-datasheet-182189377.pdf?src-supplier=IHS; ComponentLink16URL: https://datasheet.octopart.com:443/AC1206JR-0710KL-Yageo-datasheet-86786639.pdf?src-supplier=Upverter; ComponentLink16Description: https://datasheet.octopart.com:443/AC1206JR-0710KL-Yageo-datasheet-86786639.pdf?src-supplier=Upverter; ComponentLink17URL: https://datasheet.octopart.com:443/AC1206JR-0710KL-Yageo-datasheet-178509465.pdf?src-supplier=Newark; ComponentLink17Description: https://datasheet.octopart.com:443/AC1206JR-0710KL-Yageo-datasheet-178509465.pdf?src-supplier=Newark; ComponentLink18URL: https://datasheet.octopart.com:443/AC1206JR-0710KL-Yageo-datasheet-166720450.pdf?src-supplier=JRH+Electronics; ComponentLink18Description: https://datasheet.octopart.com:443/AC1206JR-0710KL-Yageo-datasheet-166720450.pdf?src-supplier=JRH+Electronics; ComponentLink19URL: https://datasheet.octopart.com:443/AC1206JR-0710KL-Yageo-Group-datasheet-188689268.pdf?src-supplier=Farnell; ComponentLink19Description: https://datasheet.octopart.com:443/AC1206JR-0710KL-Yageo-Group-datasheet-188689268.pdf?src-supplier=Farnell; ComponentLink20URL: https://datasheet.octopart.com:443/AC1206JR-0710KL-Yageo-Group-datasheet-164768995.pdf?src-supplier=ODG+(Origin+Data+Global); ComponentLink20Description: https://datasheet.octopart.com:443/AC1206JR-0710KL-Yageo-Group-datasheet-164768995.pdf?src-supplier=ODG+(Origin+Data+Global); ComponentLink21URL: https://datasheet.octopart.com:443/AC1206JR-0710KL-Yageo-datasheet-151884373.pdf?src-supplier=Future+Electronics; ComponentLink21Description: https://datasheet.octopart.com:443/AC1206JR-0710KL-Yageo-datasheet-151884373.pdf?src-supplier=Future+Electronics; ComponentLink22URL: https://datasheet.octopart.com:443/AC1206JR-0710KL-Yageo-datasheet-137699919.pdf?src-supplier=Future+Electronics; ComponentLink22Description: https://datasheet.octopart.com:443/AC1206JR-0710KL-Yageo-datasheet-137699919.pdf?src-supplier=Future+Electronics; ComponentLink23URL: https://datasheet.octopart.com:443/AC1206JR-0710KL-Yageo-datasheet-83209224.pdf?src-supplier=Future+Electronics; ComponentLink23Description: https://datasheet.octopart.com:443/AC1206JR-0710KL-Yageo-datasheet-83209224.pdf?src-supplier=Future+Electronics; ComponentLink24URL: https://datasheet.octopart.com:443/AC1206JR-0710KL-Yageo-datasheet-62139191.pdf?src-supplier=Future+Electronics; ComponentLink24Description: https://datasheet.octopart.com:443/AC1206JR-0710KL-Yageo-datasheet-62139191.pdf?src-supplier=Future+Electronics; ComponentLink25URL: https://datasheet.octopart.com/AC1206JR-0710KL-Yageo-datasheet-12512238.pdf; ComponentLink25Description: https://datasheet.octopart.com/AC1206JR-0710KL-Yageo-datasheet-12512238.pdf; Contact Plating: Tin; Radiation Hardening: No; ComponentLink26URL: https://datasheet.octopart.com:443/RC1206JR-1310KL-Yageo-datasheet-175887523.pdf?src-supplier=IHS; ComponentLink26Description: https://datasheet.octopart.com:443/RC1206JR-1310KL-Yageo-datasheet-175887523.pdf?src-supplier=IHS; ComponentLink27URL: https://datasheet.octopart.com:443/RC1206JR-1310KL-Yageo-datasheet-164759695.pdf?src-supplier=Future+Electronics; ComponentLink27Description: https://datasheet.octopart.com:443/RC1206JR-1310KL-Yageo-datasheet-164759695.pdf?src-supplier=Future+Electronics; ComponentLink28URL: https://datasheet.octopart.com:443/RC1206JR-1310KL-Yageo-datasheet-137700087.pdf?src-supplier=Future+Electronics; ComponentLink28Description: https://datasheet.octopart.com:443/RC1206JR-1310KL-Yageo-datasheet-137700087.pdf?src-supplier=Future+Electronics; ComponentLink29URL: https://datasheet.octopart.com:443/RC1206JR-1310KL-Yageo-datasheet-27233761.pdf?src-supplier=Future+Electronics; ComponentLink29Description: https://datasheet.octopart.com:443/RC1206JR-1310KL-Yageo-datasheet-27233761.pdf?src-supplier=Future+Electronics; ComponentLink30URL: https://datasheet.octopart.com:443/RC1206JR-1310KL-Yageo-datasheet-13032847.pdf?src-supplier=Future+Electronics; ComponentLink30Description: https://datasheet.octopart.com:443/RC1206JR-1310KL-Yageo-datasheet-13032847.pdf?src-supplier=Future+Electronics; ComponentLink31URL: https://datasheet.octopart.com:443/RC1206JR-1310KL-Yageo-datasheet-8359522.pdf?src-supplier=Future+Electronics; ComponentLink31Description: https://datasheet.octopart.com:443/RC1206JR-1310KL-Yageo-datasheet-8359522.pdf?src-supplier=Future+Electronics; ComponentLink32URL: https://datasheet.octopart.com/RC1206JR-1310KL-Yageo-datasheet-73766026.pdf; ComponentLink32Description: https://datasheet.octopart.com/RC1206JR-1310KL-Yageo-datasheet-73766026.pdf
R5 R6 = RC1206FR-075K1L: RES 5.1K OHM 1% 1/4W 1206; Manufacturer: Yageo Group; Manufacturer Part Number: RC0402FR-075K1L; Max Power Dissipation: 63mW; Power Dissipation: 62.5mW; Value: 5.1kΩ; Temperature Coefficient: 100ppm/°C; Voltage Rating: 50V; Supplier: DigiKey; Supplier Part Number: 311-5.10KLRCT-ND; RoHS: Compliant; Category: Chip SMD Resistors; Stock: 251126; Pricing: 1=0.1, 10=0.008, 25=0.0072, 50=0.0062, 100=0.0056, 250=0.00308 (USD); Case/Package: 0402; Case Code (Imperial): 0402; China RoHS: Non-Compliant; Composition: Thick Film; Depth: 500µm; Features: Moisture Resistant; Height: 350µm; Lead Free: Lead Free; Length: 1mm; Lifecycle Status: Production; Max Operating Temperature: 155°C; Military Standard: Not; Min Operating Temperature: -55°C; Mounting Technology: Surface Mount; Pins: 2; Number of Terminals: 2; Number of Terminations: 2; Packaging: Cut Tape; Power Rating: 63mW; REACH SVHC: Yes; Schedule B: 8533210045, 8533210045|8533210045, 8533210045|8533210045|8533210045, 8533210045|8533210045|8533210045|8533210045; Termination: SMD/SMT; Tolerance: 1%; Voltage Rating (DC): 50V; Width: 500µm; Working Voltage: 50V; ComponentLink1URL: https://datasheet.octopart.com:443/RC0402FR-075K1L-Yageo-datasheet-175887523.pdf?src-supplier=IHS; ComponentLink1Description: https://datasheet.octopart.com:443/RC0402FR-075K1L-Yageo-datasheet-175887523.pdf?src-supplier=IHS; ComponentLink2URL: https://datasheet.octopart.com:443/RC0402FR-075K1L-Yageo-datasheet-103092701.pdf?src-supplier=Upverter; ComponentLink2Description: https://datasheet.octopart.com:443/RC0402FR-075K1L-Yageo-datasheet-103092701.pdf?src-supplier=Upverter; ComponentLink3URL: https://datasheet.octopart.com:443/RC0402FR-075K1L-Yageo-datasheet-10408619.pdf?src-supplier=Newark; ComponentLink3Description: https://datasheet.octopart.com:443/RC0402FR-075K1L-Yageo-datasheet-10408619.pdf?src-supplier=Newark; ComponentLink4URL: https://datasheet.octopart.com:443/RC0402FR-075K1L-Yageo-datasheet-8324527.pdf?src-supplier=Newark; ComponentLink4Description: https://datasheet.octopart.com:443/RC0402FR-075K1L-Yageo-datasheet-8324527.pdf?src-supplier=Newark; ComponentLink5URL: https://datasheet.octopart.com:443/RC0402FR-075K1L-Yageo-datasheet-62067350.pdf?src-supplier=element14+APAC; ComponentLink5Description: https://datasheet.octopart.com:443/RC0402FR-075K1L-Yageo-datasheet-62067350.pdf?src-supplier=element14+APAC; ComponentLink6URL: https://datasheet.octopart.com:443/RC0402FR-075K1L-Yageo-datasheet-164759695.pdf?src-supplier=Future+Electronics; ComponentLink6Description: https://datasheet.octopart.com:443/RC0402FR-075K1L-Yageo-datasheet-164759695.pdf?src-supplier=Future+Electronics; ComponentLink7URL: https://datasheet.octopart.com:443/RC0402FR-075K1L-Yageo-datasheet-137700087.pdf?src-supplier=Future+Electronics; ComponentLink7Description: https://datasheet.octopart.com:443/RC0402FR-075K1L-Yageo-datasheet-137700087.pdf?src-supplier=Future+Electronics; ComponentLink8URL: https://datasheet.octopart.com:443/RC0402FR-075K1L-Yageo-datasheet-12531192.pdf?src-supplier=Future+Electronics; ComponentLink8Description: https://datasheet.octopart.com:443/RC0402FR-075K1L-Yageo-datasheet-12531192.pdf?src-supplier=Future+Electronics; ComponentLink9URL: https://datasheet.octopart.com:443/RC0402FR-075K1L-Yageo-datasheet-505231.pdf?src-supplier=Future+Electronics; ComponentLink9Description: https://datasheet.octopart.com:443/RC0402FR-075K1L-Yageo-datasheet-505231.pdf?src-supplier=Future+Electronics; ComponentLink10URL: https://datasheet.octopart.com:443/RC0402FR-075K1L-Yageo-datasheet-148775077.pdf?src-supplier=TME; ComponentLink10Description: https://datasheet.octopart.com:443/RC0402FR-075K1L-Yageo-datasheet-148775077.pdf?src-supplier=TME; ComponentLink11URL: https://datasheet.octopart.com/RC0402FR-075K1L-Yageo-datasheet-73766026.pdf; ComponentLink11Description: https://datasheet.octopart.com/RC0402FR-075K1L-Yageo-datasheet-73766026.pdf; ComponentLink12URL: https://datasheet.octopart.com:443/RC0402FR-075K1L-Yageo-datasheet-8329306.pdf?src-supplier=element14; ComponentLink12Description: https://datasheet.octopart.com:443/RC0402FR-075K1L-Yageo-datasheet-8329306.pdf?src-supplier=element14; ComponentLink13URL: http://sigma.octopart.com:80/rohs_statement/Yageo-company-2.pdf?src-supplier=Compliance+Statements; ComponentLink13Description: http://sigma.octopart.com:80/rohs_statement/Yageo-company-2.pdf?src-supplier=Compliance+Statements; ComponentLink14URL: http://sigma.octopart.com:80/conflict_mineral_statement/Yageo-company-3.pdf?src-supplier=Compliance+Statements; ComponentLink14Description: http://sigma.octopart.com:80/conflict_mineral_statement/Yageo-company-3.pdf?src-supplier=Compliance+Statements; LCSC PART NUMBER: C163372
R8 = RC1206FR-0722K1L: RES 22.1K OHM 1% 1/4W 1206; Manufacturer: Yageo Group; Manufacturer Part Number: AC0402FR-0722K1L; Max Power Dissipation: 63mW; Power Dissipation: 62.5mW; Value: 22.1kΩ; Temperature Coefficient: 100ppm/°C; Voltage Rating: 50V; Supplier: DigiKey; Supplier Part Number: YAG3457CT-ND; RoHS: Compliant; Category: Chip SMD Resistors; Stock: 23159; Pricing: 1=0.1, 10=0.009, 25=0.008, 50=0.0072, 100=0.0066, 250=0.00408, 500=0.00406 (USD); Case/Package: 0402; Case Code (Imperial): 0402; Case Code (Metric): 1005; China RoHS: Non-Compliant; Composition: Thick Film; Features: Automotive AEC-Q200, Moisture Resistant; Height: 320µm; Length: 990.6µm; Lifecycle Status: Production; Max Operating Temperature: 155°C; Min Operating Temperature: -55°C; Mounting Technology: Surface Mount; Number of Terminals: 2; Number of Terminations: 2; Packaging: Tape & Reel; Power Rating: 62.5mW; REACH SVHC: Yes; Schedule B: 8533210045, 8533210045|8533210045|8533210045|8533210045|8533210045; Tolerance: 1%; Width: 500µm; Working Voltage: 50V; ComponentLink1URL: https://datasheet.octopart.com:443/AC0402FR-0722K1L-Yageo-datasheet-182189377.pdf?src-supplier=IHS; ComponentLink1Description: https://datasheet.octopart.com:443/AC0402FR-0722K1L-Yageo-datasheet-182189377.pdf?src-supplier=IHS; ComponentLink2URL: https://datasheet.octopart.com:443/AC0402FR-0722K1L-Yageo-datasheet-83209224.pdf?src-supplier=Upverter; ComponentLink2Description: https://datasheet.octopart.com:443/AC0402FR-0722K1L-Yageo-datasheet-83209224.pdf?src-supplier=Upverter; ComponentLink3URL: https://datasheet.octopart.com:443/AC0402FR-0722K1L-Yageo-datasheet-178509465.pdf?src-supplier=Newark; ComponentLink3Description: https://datasheet.octopart.com:443/AC0402FR-0722K1L-Yageo-datasheet-178509465.pdf?src-supplier=Newark; ComponentLink4URL: https://datasheet.octopart.com:443/AC0402FR-0722K1L-Yageo-datasheet-166720450.pdf?src-supplier=Future+Electronics; ComponentLink4Description: https://datasheet.octopart.com:443/AC0402FR-0722K1L-Yageo-datasheet-166720450.pdf?src-supplier=Future+Electronics; ComponentLink5URL: https://datasheet.octopart.com:443/AC0402FR-0722K1L-Yageo-datasheet-151884373.pdf?src-supplier=Future+Electronics; ComponentLink5Description: https://datasheet.octopart.com:443/AC0402FR-0722K1L-Yageo-datasheet-151884373.pdf?src-supplier=Future+Electronics; ComponentLink6URL: https://datasheet.octopart.com:443/AC0402FR-0722K1L-Yageo-datasheet-137699919.pdf?src-supplier=Future+Electronics; ComponentLink6Description: https://datasheet.octopart.com:443/AC0402FR-0722K1L-Yageo-datasheet-137699919.pdf?src-supplier=Future+Electronics; ComponentLink7URL: https://datasheet.octopart.com:443/AC0402FR-0722K1L-Yageo-datasheet-86786639.pdf?src-supplier=Future+Electronics; ComponentLink7Description: https://datasheet.octopart.com:443/AC0402FR-0722K1L-Yageo-datasheet-86786639.pdf?src-supplier=Future+Electronics; ComponentLink8URL: https://datasheet.octopart.com:443/AC0402FR-0722K1L-Yageo-datasheet-128677973.pdf?src-supplier=X-ON; ComponentLink8Description: https://datasheet.octopart.com:443/AC0402FR-0722K1L-Yageo-datasheet-128677973.pdf?src-supplier=X-ON; ComponentLink9URL: https://datasheet.octopart.com/AC0402FR-0722K1L-Yageo-datasheet-12512238.pdf; ComponentLink9Description: https://datasheet.octopart.com/AC0402FR-0722K1L-Yageo-datasheet-12512238.pdf; ComponentLink10URL: http://sigma.octopart.com:80/rohs_statement/Yageo-company-2.pdf?src-supplier=Compliance+Statements; ComponentLink10Description: http://sigma.octopart.com:80/rohs_statement/Yageo-company-2.pdf?src-supplier=Compliance+Statements; ComponentLink11URL: http://sigma.octopart.com:80/conflict_mineral_statement/Yageo-company-3.pdf?src-supplier=Compliance+Statements; ComponentLink11Description: http://sigma.octopart.com:80/conflict_mineral_statement/Yageo-company-3.pdf?src-supplier=Compliance+Statements; LCSC PART NUMBER: C488737